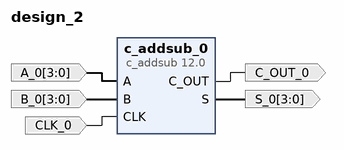
[diagram p0: block diagram of the top level]
# Vivado block design design_2, xc7z020clg484-1, Vivado 2018.2
create_bd_design design_2

create_bd_port -dir I -from 3 -to 0 -type data A_0
create_bd_port -dir I -from 3 -to 0 -type data B_0
create_bd_port -dir I -type clk CLK_0
create_bd_port -dir O -type data C_OUT_0
create_bd_port -dir O -from 3 -to 0 -type data S_0

create_bd_cell -type ip -vlnv xilinx.com:ip:c_addsub:12.0 c_addsub_0
set_property -dict [list \
  CONFIG.A_Type Unsigned \
  CONFIG.B_Type Unsigned \
  CONFIG.A_Width 4 \
  CONFIG.B_Width 4 \
  CONFIG.Out_Width 4 \
  CONFIG.Latency 1 \
  CONFIG.B_Value 0000 \
  CONFIG.CE false \
  CONFIG.C_Out true \
] [get_bd_cells c_addsub_0]

# ---- connections ----

connect_bd_net -net A_0_1 [get_bd_ports A_0] [get_bd_pins c_addsub_0/A]
connect_bd_net -net B_0_1 [get_bd_ports B_0] [get_bd_pins c_addsub_0/B]
connect_bd_net [get_bd_pins c_addsub_0/C_OUT] [get_bd_ports C_OUT_0]
connect_bd_net [get_bd_pins c_addsub_0/S] [get_bd_ports S_0]
connect_bd_net -net CLK_0_1 [get_bd_ports CLK_0] [get_bd_pins c_addsub_0/CLK]

validate_bd_design
save_bd_design
